# Altium schematic sheet Main.SchDoc
size A3; PageSetup: Record=PageOptions|CenterHorizontal=True|CenterVertical=True|PrintScale=1.47|XCorrection=1.00|YCorrection=1.00|PrintKind=1|BorderSize=5000000|LeftOffset=0|BottomOffset=0|Orientation=2|PaperLength=1000|PaperWidth=1000|Scale=100|PaperSource=7|PrintQuality=-4|MediaType=1|DitherType=10|PrintScaleMode=1|PaperKind=A2 420 x 594 мм
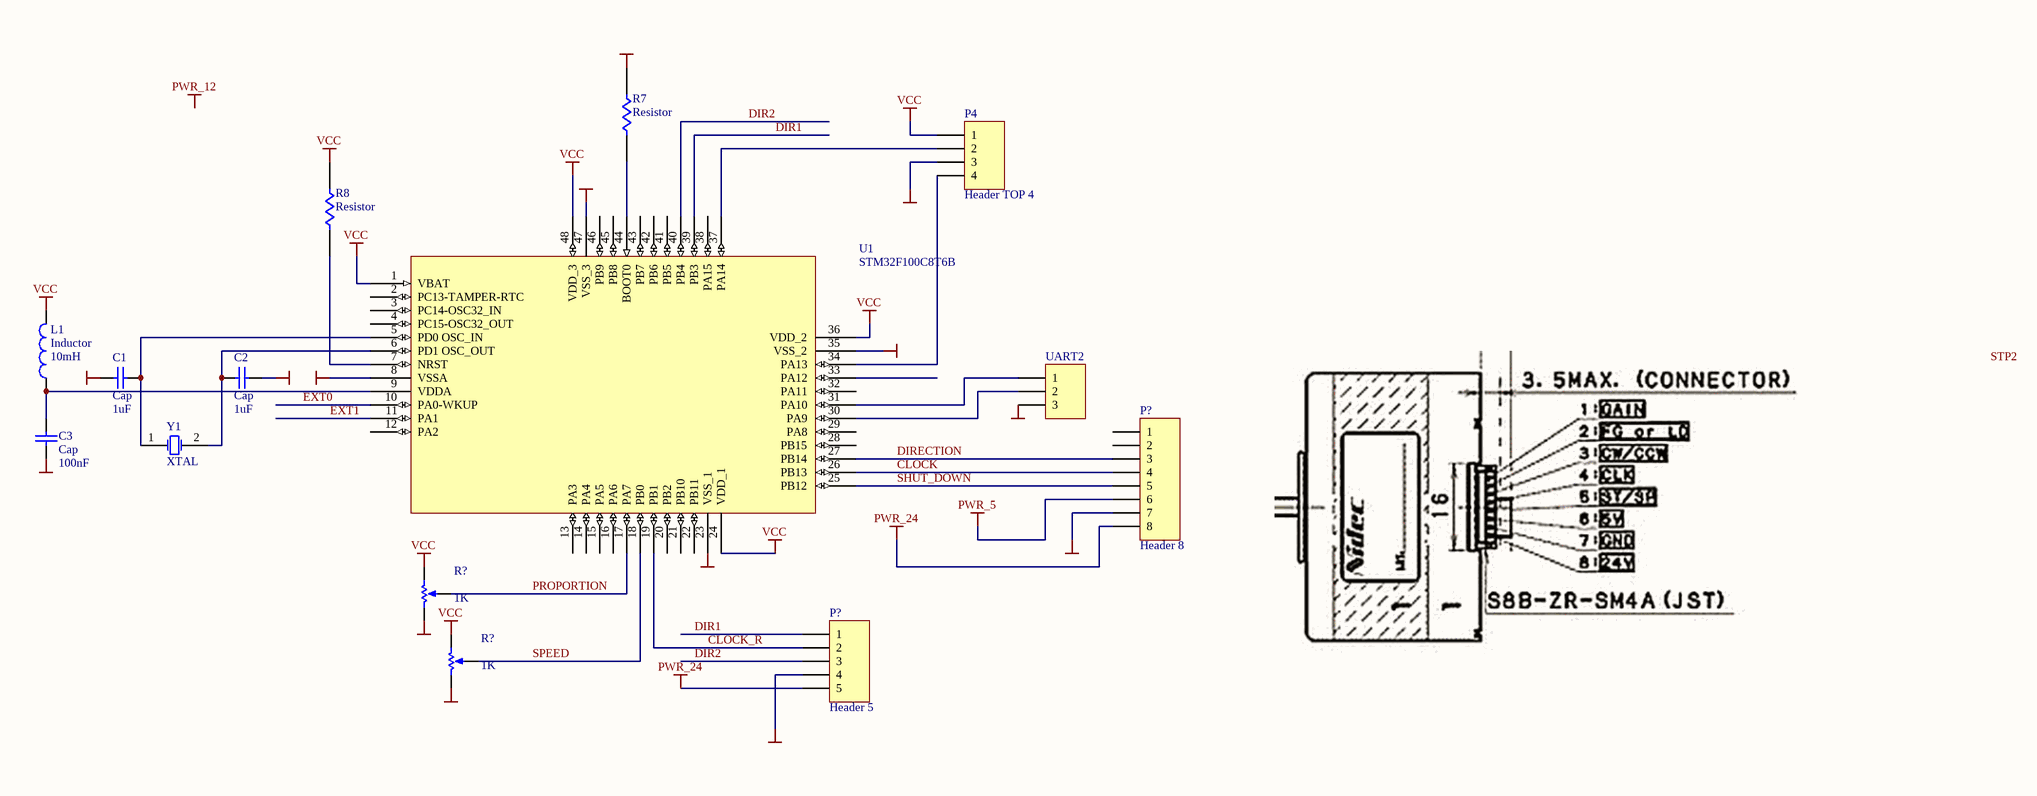
[diagram p0: Main.SchDoc]

## Parts
(Parts that share a designator on the sheet are numbered #1, #2 ... from top to bottom, then left to right.)
C1  Cap  value 1uF  [6-0805_M]
C2  Cap  value 1uF  [6-0805_M]
C3  Cap  value 100nF  [6-0805_M]
L1  Inductor  value 10mH  [INDC4532]
P4  Header TOP 4  [PIN_TOP_SMALL_4]
P?#1  Header 8  [HDR1X8]
P?#2  Header 5  [HDR1X5]
R7  Resistor  [6-0805_M]
R8  Resistor  [6-0805_M]
R?#1  value 1K  [VR5]  (hidden comment: RPot)
R?#2  value 1K  [VR5]  (hidden comment: RPot)
U1  STM32F100C8T6B  [TQFP48_L]
UART2  Header TOP 3  [PIN_TOP_SMALL_3]  (value not drawn)
Y1  XTAL  [RAD-0.3]

## Nets
GND: C1.2 C2.1 C3.1 P4.3 P?#1.7 P?#2.4 R7.1 R?#1.2(BOT) R?#2.2(BOT) U1.8(VSSA) U1.23(VSS_1) U1.35(VSS_2) U1.47(VSS_3) UART2.3
PWR_5: P?#1.6
PWR_24: P?#1.8 P?#2.5
VCC: L1.2 P4.1 R8.1 R?#1.1(TOP) R?#2.1(TOP) U1.1(VBAT) U1.24(VDD_1) U1.36(VDD_2) U1.48(VDD_3)
CLOCK: P?#1.4 U1.26(PB13)
CLOCK_R: P?#2.2 U1.19(PB1)
DIR1: P?#2.1 U1.39(PB3)
DIR2: P?#2.3 U1.40(PB4)
DIRECTION: P?#1.3 U1.27(PB14)
EXT0: U1.10(PA0-WKUP)
EXT1: U1.11(PA1)
PROPORTION: R?#1.3(TAP) U1.17(PA7)
SHUT_DOWN: P?#1.5 U1.25(PB12)
SPEED: R?#2.3(TAP) U1.18(PB0)
NetC1_1: C1.1 U1.5(PD0_OSC_IN) Y1.1(OSC1)
NetC2_2: C2.2 U1.6(PD1_OSC_OUT) Y1.2(OSC2)
NetC3_2: C3.2 L1.1 U1.9(VDDA)
NetP4_2: P4.2 U1.37(PA14)
NetP4_4: P4.4 U1.34(PA13)
NetR7_2: R7.2 U1.44(BOOT0)
NetR8_2: R8.2 U1.7(NRST)
NetU1_30: U1.30(PA9) UART2.2
NetU1_31: U1.31(PA10) UART2.1

Not connected (* = marked no-connect by the designer): P?#1 1 2; U1 2(PC13-TAMPER-RTC) 3(PC14-OSC32_IN) 4(PC15-OSC32_OUT) 12(PA2) 13(PA3) 14(PA4) 15(PA5) 16(PA6) 20(PB2) 21(PB10) 22(PB11) 28(PB15) 29(PA8) 32(PA11) 33(PA12) 38(PA15) 41(PB5) 42(PB6) 43(PB7) 45(PB8) 46(PB9)

## Notes on the sheet
- Labels drawn without touching a wire or pin: PWR_12, STP2

## Library data of the parts
C1-C3 = Cap: Capacitor; Published: 8-Jun-2000; LatestRevisionDate: 17-Jul-2002; LatestRevisionNote: Re-released for DXP Platform.; PackageReference: RAD-0.3; Publisher: Altium Limited; PackageDescription: Radial Cap, Thru-Hole; 2 Leads; 0.3 in Pin Spacing
L1 = Inductor: Code_IEC: 1005; Published: 8-Jun-2000; LatestRevisionDate: 29-May-2009; LatestRevisionNote: IPC-7351 Footprint Added.; PackageReference: 0402-A; Publisher: Altium Limited; PackageDescription: Chip Inductor; Code_JEITA: 0402
P4 = Header TOP 4: Header, 1Pin; LatestRevisionDate: 17-Jul-2002; LatestRevisionNote: Re-released for DXP Platform.; Publisher: Altium Limited
P?#1 = Header 8: Header, 8-Pin; LatestRevisionDate: 17-Jul-2002; LatestRevisionNote: Re-released for DXP Platform.; Publisher: Altium Limited
P?#2 = Header 5: Header, 5-Pin; LatestRevisionDate: 17-Jul-2002; LatestRevisionNote: Re-released for DXP Platform.; Publisher: Altium Limited
R?#1 R?#2 = RPot: Potentiometer; Sim Note: Enter the Resistance value and the set point into parameter fields.; Set Position: 0.5; Published: 8-Jun-2000; LatestRevisionDate: 17-Jul-2002; LatestRevisionNote: Re-released for DXP Platform.; PackageReference: VR5; Publisher: Altium Limited; PackageDescription: Variable Resistor, Thru-Hole; 3 Leads
U1 = STM32F100C8T6B: STM32 ARM-based 32-bit MCU with 32 Kbytes Flash, 48-pin LQFP, Industrial Temperature; Published: 30-May-2008; DatasheetVersion: rev6, Mar-2008; PackageVersion: Mar-2008; PackageReference: LQFP48; Publisher: Altium Limited; PackageDescription: 48-Pin Low-Profile Quad Flat Pack, 7 x 7 mm Body, 0.5 mm Pitch (LQFP48); ComponentLink1Description: Manufacturer Link; ComponentLink1URL: www.st.com/stm32; ComponentLink2Description: Datasheet; ComponentLink2URL: http://www.st.com/stonline/products/literature/ds/13586.pdf
UART2 = Header TOP 3: Header, 1Pin; LatestRevisionDate: 17-Jul-2002; LatestRevisionNote: Re-released for DXP Platform.; Publisher: Altium Limited
Y1 = XTAL: Crystal Oscillator; Published: 8-Jun-2000; LatestRevisionDate: 17-Jul-2002; LatestRevisionNote: Re-released for DXP Platform.; PackageReference: R38; Publisher: Altium Limited; PackageDescription: Crystal, Thru-Hole; 2 Leads; Body 3.1 x 8.2 mm (Dia.xH)
R7 R8 = Resistor: Published: 24-Mar-1999; LatestRevisionDate: 29-May-2009; LatestRevisionNote: IPC-7351 Footprint Added.; PackageVersion: Mar-2003; PackageReference: 6-0805; Publisher: Altium Limited; PackageDescription: Chip Resistor 0805 Case Size; Code_IPC: RESC2012